# EAGLE design EskomSePush (EAGLE 9.6.2)
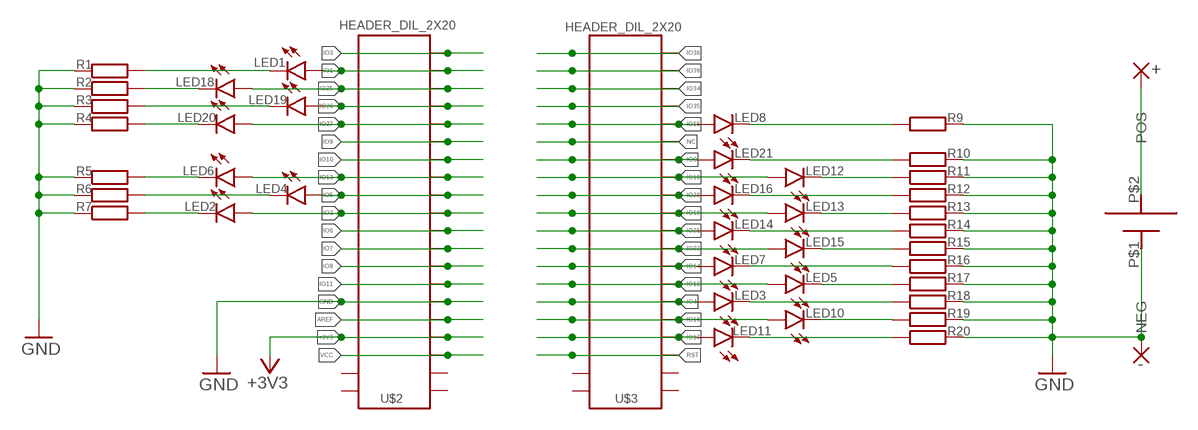
[diagram p0: schematic, sheet 1]

## Parts
+  WIREPADSMD2,54-5,08  [SMD2,54-5,08]
-  WIREPADSMD2,54-5,08  [SMD2,54-5,08]
LED1  LEDCHIPLED_1206  [CHIPLED_1206]
LED2  LEDCHIPLED_1206  [CHIPLED_1206]
LED3  LEDCHIPLED_1206  [CHIPLED_1206]
LED4  LEDCHIPLED_1206  [CHIPLED_1206]
LED5  LEDCHIPLED_1206  [CHIPLED_1206]
LED6  LEDCHIPLED_1206  [CHIPLED_1206]
LED7  LEDCHIPLED_1206  [CHIPLED_1206]
LED8  LEDCHIPLED_1206  [CHIPLED_1206]
LED10  LEDCHIPLED_1206  [CHIPLED_1206]
LED11  LEDCHIPLED_1206  [CHIPLED_1206]
LED12  LEDCHIPLED_1206  [CHIPLED_1206]
LED13  LEDCHIPLED_1206  [CHIPLED_1206]
LED14  LEDCHIPLED_1206  [CHIPLED_1206]
LED15  LEDCHIPLED_1206  [CHIPLED_1206]
LED16  LEDCHIPLED_1206  [CHIPLED_1206]
LED18  LEDCHIPLED_1206  [CHIPLED_1206]
LED19  LEDCHIPLED_1206  [CHIPLED_1206]
LED20  LEDCHIPLED_1206  [CHIPLED_1206]
LED21  LEDCHIPLED_1206  [CHIPLED_1206]
R1  R-EU_R1206  [R1206]
R2  R-EU_R1206  [R1206]
R3  R-EU_R1206  [R1206]
R4  R-EU_R1206  [R1206]
R5  R-EU_R1206  [R1206]
R6  R-EU_R1206  [R1206]
R7  R-EU_R1206  [R1206]
R9  R-EU_R1206  [R1206]
R10  R-EU_R1206  [R1206]
R11  R-EU_R1206  [R1206]
R12  R-EU_R1206  [R1206]
R13  R-EU_R1206  [R1206]
R14  R-EU_R1206  [R1206]
R15  R-EU_R1206  [R1206]
R16  R-EU_R1206  [R1206]
R17  R-EU_R1206  [R1206]
R18  R-EU_R1206  [R1206]
R19  R-EU_R1206  [R1206]
R20  R-EU_R1206  [R1206]
U$1  21700BATTERYHOLDER  [21700BATTERYHOLDER]
U$2  HEADER_DIL_2X20  [HEADER_DIL_2X20]
U$3  HEADER_DIL_2X20  [HEADER_DIL_2X20]

## Nets
+3V3: U$2.P$17 U$2.P$37
AREF: U$2.P$16 U$2.P$36
GND: -.1(P) R1.1 R2.1 R3.1 R4.1 R5.1 R6.1 R7.1 R9.2 R10.2 R11.2 R12.2 R13.2 R14.2 R15.2 R16.2 R17.2 R18.2 R19.2 R20.2 U$1.P$1(NEG) U$2.P$15 U$2.P$35
IO0: LED21.A U$3.P$7 U$3.P$27
IO1: LED1.A U$2.P$2 U$2.P$22
IO2: LED2.A U$2.P$10 U$2.P$30
IO3: U$2.P$1 U$2.P$21
IO4: LED3.A U$3.P$15 U$3.P$35
IO5: LED4.A U$2.P$9 U$2.P$29
IO6: U$2.P$11 U$2.P$31
IO7: U$2.P$12 U$2.P$32
IO8: U$2.P$13 U$2.P$33
IO9: U$2.P$6 U$2.P$26
IO10: U$2.P$7 U$2.P$27
IO11: U$2.P$14 U$2.P$34
IO12: LED5.A U$3.P$14 U$3.P$34
IO13: LED6.A U$2.P$8 U$2.P$28
IO14: LED7.A U$3.P$13 U$3.P$33
IO15: LED8.A U$3.P$5 U$3.P$25
IO16: LED10.A U$3.P$16 U$3.P$36
IO17: LED11.A U$3.P$17 U$3.P$37
IO18: LED12.A U$3.P$8 U$3.P$28
IO19: LED13.A U$3.P$10 U$3.P$30
IO21: LED14.A U$3.P$11 U$3.P$31
IO22: LED15.A U$3.P$12 U$3.P$32
IO23: LED16.A U$3.P$9 U$3.P$29
IO25: LED18.A U$2.P$3 U$2.P$23
IO26: LED19.A U$2.P$4 U$2.P$24
IO27: LED20.A U$2.P$5 U$2.P$25
IO34: U$3.P$3 U$3.P$23
IO35: U$3.P$4 U$3.P$24
IO36: U$3.P$1 U$3.P$21
IO39: U$3.P$2 U$3.P$22
N$1: LED1.C R1.2
N$2: LED18.C R2.2
N$3: LED19.C R3.2
N$5: LED20.C R4.2
N$6: LED4.C R6.2
N$7: LED2.C R7.2
N$8: LED6.C R5.2
N$9: LED8.C R9.1
N$10: LED21.C R10.1
N$11: LED12.C R11.1
N$12: LED16.C R12.1
N$13: LED13.C R13.1
N$14: LED14.C R14.1
N$15: LED15.C R15.1
N$16: LED5.C R17.1
N$17: LED7.C R16.1
N$18: LED3.C R18.1
N$19: LED10.C R19.1
N$20: LED11.C R20.1
N$28: +.1(P) U$1.P$2(POS)
NC: U$3.P$6 U$3.P$26
RST: U$3.P$18 U$3.P$38
VCC: U$2.P$18 U$2.P$38
Unconnected: U$2.P$19 U$2.P$20 U$2.P$39 U$2.P$40 U$3.P$19 U$3.P$20 U$3.P$39 U$3.P$40

## Library data of the parts
+ - = wirepad:WIREPAD: Wire PAD connect wire on PCB
LED1-LED8 LED10-LED16 LED18-LED21 = led:LED: LED OSRAM: - CHIPLED LG R971, LG N971, LY N971, LG Q971, LY Q971, LO R971, LY R971 LH N974, LH R974 LS Q976, LO Q976, LY Q976 LO Q996 - Hyper CHIPLED LW Q18S LB Q993, LB Q99A, LB R99A - SideLED LS A670, LO A670, LY A670, LG A670, LP A670 LB A673, LV A673, LT A673, LW A673 LH A674 LY A675 LS A676, LA A676, LO A676, LY A676, LW A676 LS A679, LY A679, LG A679 - Hyper Micro SIDELED® LS Y876, LA Y876, LO Y876, LY Y876 LT Y87S - SmartLED LW L88C, LW L88S LB L89C, LB L89S, LG L890 LS L89K, LO L89K, LY L89K LS L896, LA L896, LO L896, LY L896 - TOPLED LS T670, LO T670, LY T670, LG T670, LP T670 LSG T670, LSP T670, LSY T670, LOP T670, LYG T670 LG T671, LOG T671, LSG T671 LB T673, LV T673, LT T673, LW T673 LH T674 LS T676, LA T676, LO T676, LY T676, LB T676, LH T676, LSB T676, LW T676 LB T67C, LV T67C, LT T67C, LS T67K, LO T67K, LY T67K, LW E67C LS E67B, LA E67B, LO E67B, LY E67B, LB E67C, LV E67C, LT E67C LW T67C LS T679, LY T679, LG T679 LS T770, LO T770, LY T770, LG T770, LP T770 LB T773, LV T773, LT T773, LW T773 LH T774 LS E675, LA E675, LY E675, LS T675 LS T776, LA T776, LO T776, LY T776, LB T776 LHGB T686 LT T68C, LB T68C - Hyper Mini TOPLED® LB M676 - Mini TOPLED Santana® LG M470 LS M47K, LO M47K, LY M47K Source: http://www.osram.convergy.de LUXEON: - LUMILED® LXK2-PW12-R00, LXK2-PW12-S00, LXK2-PW14-U00, LXK2-PW14-V00 LXK2-PM12-R00, LXK2-PM12-S00, LXK2-PM14-U00 LXK2-PE12-Q00, LXK2-PE12-R00, LXK2-PE12-S00, LXK2-PE14-T00, LXK2-PE14-U00 LXK2-PB12-K00, LXK2-PB12-L00, LXK2-PB12-M00, LXK2-PB14-N00, LXK2-PB14-P00, LXK2-PB14-Q00 LXK2-PR12-L00, LXK2-PR12-M00, LXK2-PR14-Q00, LXK2-PR14-R00 LXK2-PD12-Q00, LXK2-PD12-R00, LXK2-PD12-S00 LXK2-PH12-R00, LXK2-PH12-S00 LXK2-PL12-P00, LXK2-PL12-Q00, LXK2-PL12-R00 Source: www.luxeon.com KINGBRIGHT: KA-3528ASYC Source: www.kingbright.com
R1-R7 R9-R20 = rcl:R-EU_: RESISTOR, European symbol; SPICEPREFIX: R
U$1 = 21700 Battery holder:21700BATTERYHOLDER
U$2 U$3 = Header SMT:HEADER_DIL_2X20

## Board
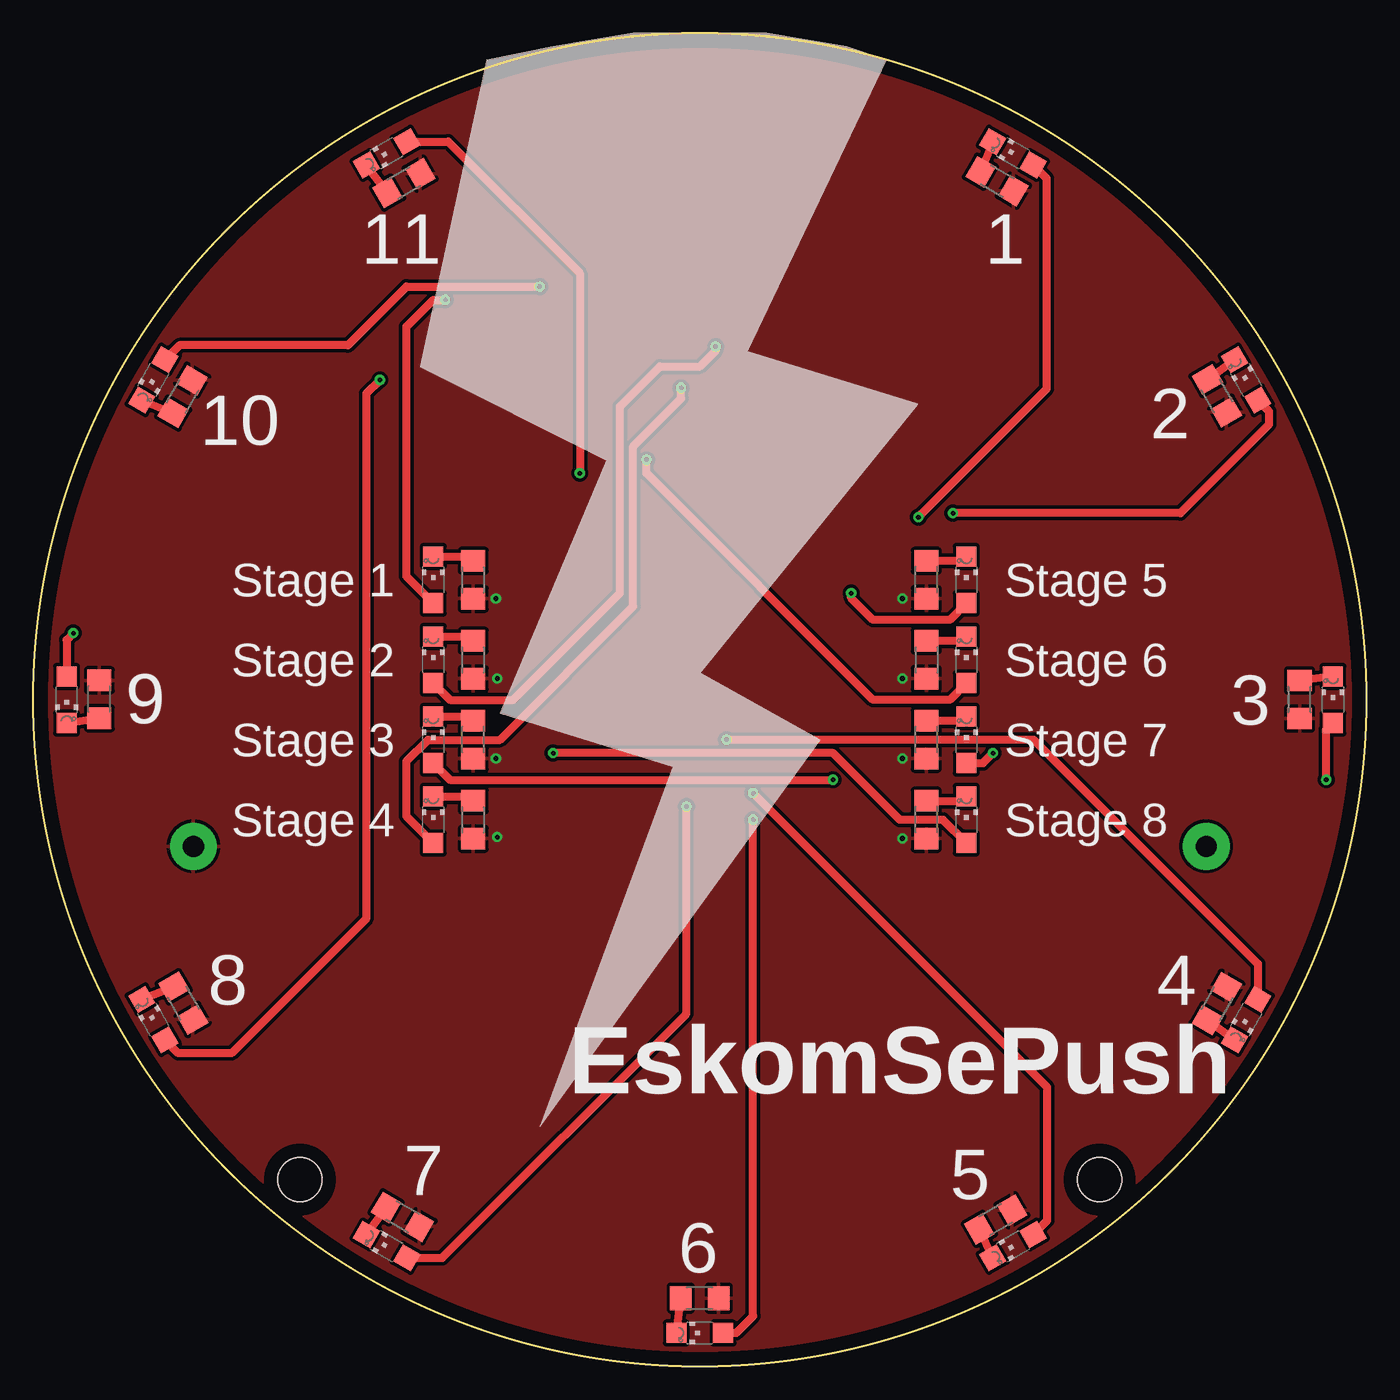
[diagram p1: board, top side]
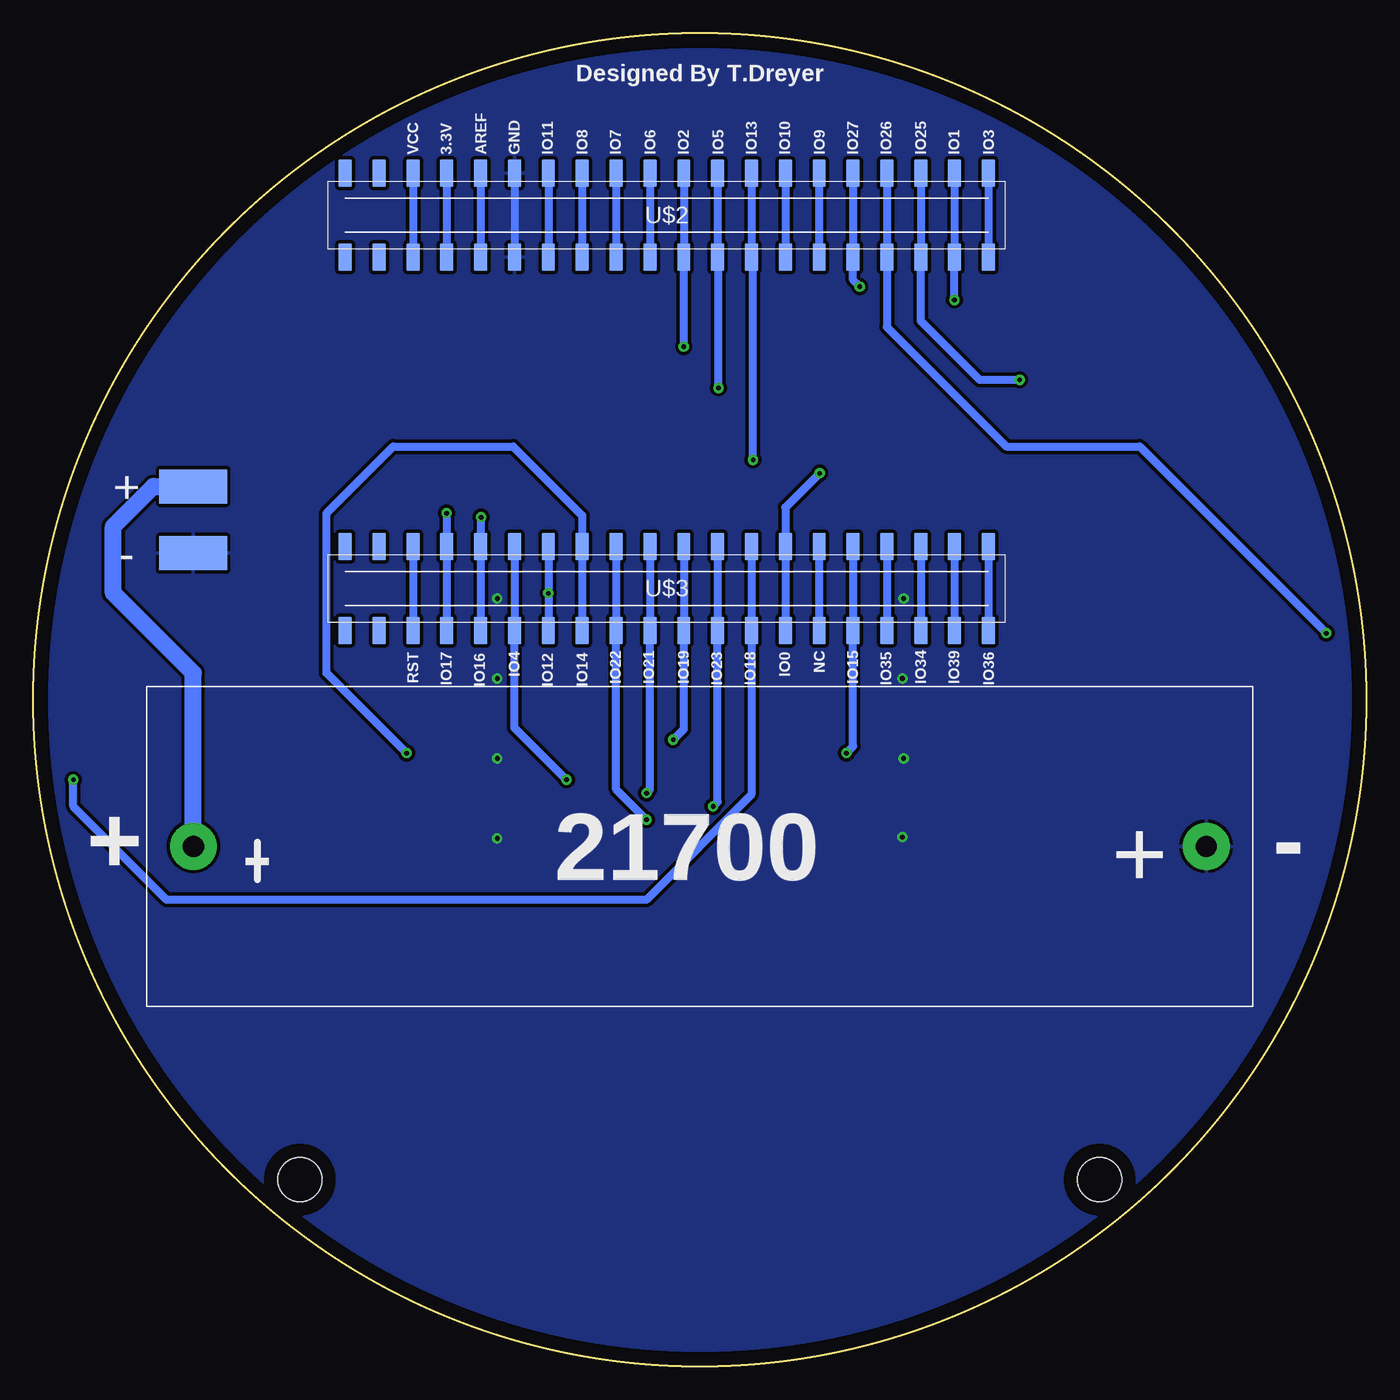
[diagram p2: board, bottom side, seen from below]

Size 100 x 100 mm. Coordinates in mm from the lower left corner, seen from the top.
Outline: circle at 50,50 radius 50
Copper layers (1*16): Top 0.035mm / dielectric 1.5mm / Bottom 0.035mm
Design rules "default *": minimum track width 6mil, minimum drill 0.35mm, track to track 10mil, track to pad 6mil, pad to pad 6mil, via to via 6mil, smd to smd 6mil, copper to edge 40mil, drill to drill 6mil, minimum pad ring 10mil, minimum via ring 8mil, stop-mask expansion 4mil, vias tented up to drill 20mil, thermal gap 10mil
Holes 3.3 mm at 20,14 80,14

### Footprints (pad centres in the part's own frame; a part is rotated, then mirrored left to right if it is on the bottom)
SMD2,54-5,08 = smd 2.54 x 5.08: 1 0,0
CHIPLED_1206 = smd 1.5 x 1.5: A 0,-1.75; C 0,1.75
R1206 = smd 1.6 x 1.803: 1 -1.422,0; 2 1.422,0
21700BATTERYHOLDER = drill 1.6 pad 3.5: P$1 -38,0; P$2 38,0
HEADER_DIL_2X20 = smd 1.02 x 2.1: P$1 0,3.15; P$2 2.54,3.15; P$3 5.08,3.15; P$4 7.62,3.15; P$5 10.16,3.15; P$6 12.7,3.15; P$7 15.24,3.15; P$8 17.78,3.15; P$9 20.32,3.15; P$10 22.86,3.15; P$11 25.4,3.15; P$12 27.94,3.15; P$13 30.48,3.15; P$14 33.02,3.15; P$15 35.56,3.15; P$16 38.1,3.15; P$17 40.64,3.15; P$18 43.18,3.15; P$19 45.72,3.15; P$20 48.26,3.15; P$21 0,-3.15; P$22 2.54,-3.15; P$23 5.08,-3.15; P$24 7.62,-3.15; P$25 10.16,-3.15; P$26 12.7,-3.15; P$27 15.24,-3.15; P$28 17.78,-3.15; P$29 20.32,-3.15; P$30 22.86,-3.15; P$31 25.4,-3.15; P$32 27.94,-3.15; P$33 30.48,-3.15; P$34 33.02,-3.15; P$35 35.56,-3.15; P$36 38.1,-3.15; P$37 40.64,-3.15; P$38 43.18,-3.15; P$39 45.72,-3.15; P$40 48.26,-3.15

### Placement (x,y rotation side)
+  88,66 270 bottom
-  88,61 270 bottom
LED1  30,59 0 top
LED2  30,53 0 top
LED3  30,47 0 top
LED4  30,41 0 top
LED5  70,59 0 top
LED6  70,53 0 top
LED7  70,47 0 top
LED8  70,41 0 top
LED10  73.5,91 60 top
LED11  91,74 30 top
LED12  97.5,50 0 top
LED13  91,26 150 top
LED14  73.5,9 120 top
LED15  50,2.5 90 top
LED16  26.5,9 60 top
LED18  9,26 30 top
LED19  2.5,50 180 top
LED20  9,74 150 top
LED21  26.5,91 120 top
R1  33,59 90 top
R2  11.25,27.24 120 top
R3  4.95,50.04 270 top
R4  11.2,72.74 240 top
R5  67,53 90 top
R6  33,41 90 top
R7  33,53 90 top
R9  67,41 270 top
R10  27.8,88.76 30 top
R11  95,50.02 270 top
R12  27.7,11.2 330 top
R13  88.8,27.2 60 top
R14  72.2,11 30 top
R15  50,5.1 0 top
R16  67,47 270 top
R17  67,59 270 top
R18  33,47 270 top
R19  72.3,88.9 330 top
R20  88.8,72.8 300 top
U$1  50,39 180 bottom
U$2  28.34,86.35 180 bottom
U$3  28.34,58.35 180 bottom

### Tracks (layer width: path | path; a pad name or v marks a point on that pad's centre or on a via)
+3V3
  Bottom 0.61: U$2.P$37 U$2.P$17
AREF
  Bottom 0.61: U$2.P$36 U$2.P$16
GND  (via drill 0.35)
  Bottom 0.61: U$2.P$35 U$2.P$15
  other vias: 65.2,57.6 65.2,51.6 65.2,45.6 65.2,39.6 34.8,39.7 34.7,45.6 34.8,51.6 34.7,57.6
  pour Top: 0,100 0,0 100,0 100,100
  pour Bottom: 0,100 0,0 100,0 100,100
IO0  (via drill 0.35)
  Top 0.61: LED21.A 31.12,91.88 41,82 v41,67
  Bottom 0.61: U$3.P$7 U$3.P$27 43.58,64.42 v41,67
IO1  (via drill 0.35)
  Top 0.61: LED1.A 28,59.25 28,78 30,80 v30.9,80
  Bottom 0.61: U$2.P$22 U$2.P$2 30.9,83.18 v30.9,80
IO2  (via drill 0.35)
  Top 0.61: LED2.A 31.25,50 36,50 44,58 44,72 47,75 50,75 51.2,76.2 v51.2,76.5
  Bottom 0.61: U$2.P$30 U$2.P$10 v51.2,76.5
IO3
  Bottom 0.61: U$2.P$21 U$2.P$1
IO4  (via drill 0.35)
  Top 0.61: LED3.A 31.25,44 v60,44
  Bottom 0.61: U$3.P$35 U$3.P$15 63.9,47.9 v60,44
IO5  (via drill 0.35)
  Top 0.61: LED4.A 28,41.25 28,45.4 29.6,47 35,47 45,57 45,69 48.6,72.6 v48.6,73.4
  Bottom 0.61: U$2.P$29 U$2.P$9 48.6,83.14 v48.6,73.4
IO6
  Bottom 0.61: U$2.P$31 U$2.P$11
IO7
  Bottom 0.61: U$2.P$32 U$2.P$12
IO8
  Bottom 0.61: U$2.P$33 U$2.P$13
IO9
  Bottom 0.61: U$2.P$26 U$2.P$6
IO10
  Bottom 0.61: U$2.P$27 U$2.P$7
IO11
  Bottom 0.61: U$2.P$34 U$2.P$14
IO12  (via drill 0.35)
  Top 0.61: LED5.A 68.75,56 63,56 61.36,57.64 v61.36,58
  Bottom 0.61: U$3.P$34 v61.36,58 U$3.P$14
IO13  (via drill 0.35)
  Top 0.61: LED6.A 68.75,50 63,50 46,67 v46,68
  Bottom 0.61: U$2.P$28 U$2.P$8 46,83.08 v46,68
IO14  (via drill 0.35)
  Top 0.61: LED7.A 71.25,45.25 v72,46
  Bottom 0.61: U$3.P$13 U$3.P$33 58.82,63.82 64,69 73,69 78,64 78,52 v72,46
IO15  (via drill 0.35)
  Top 0.61: LED8.A 68.25,41 65,41 60,46 v39,46
  Bottom 0.61: U$3.P$25 U$3.P$5 38.5,46.5 v39,46
IO16  (via drill 0.35)
  Top 0.61: LED10.A 76.02,89.12 76.02,73.32 v66.4,63.7
  Bottom 0.61: U$3.P$16 U$3.P$36 66.44,63.66 v66.4,63.7
IO17  (via drill 0.35)
  Top 0.61: LED11.A 92.71,71.65 92.71,70.65 86.06,64 v69,64
  Bottom 0.61: U$3.P$17 U$3.P$37 69,61.52 v69,64
IO18  (via drill 0.35)
  Top 0.61: v97,44 97,47.75 LED12.A
  Bottom 0.61: U$3.P$28 U$3.P$8 46.12,42.88 54,35 90,35 97,42 v97,44
IO19  (via drill 0.35)
  Top 0.61: LED13.A 91.88,30.18 75.06,47 v52,47
  Bottom 0.61: U$3.P$30 U$3.P$10 51.2,47.8 v52,47
IO21  (via drill 0.35)
  Top 0.61: v54,43 76.07,20.93 76.07,10.93 LED14.A
  Bottom 0.61: U$3.P$31 U$3.P$11 53.74,43.26 v54,43
IO22  (via drill 0.35)
  Top 0.61: LED15.A 52.75,2.5 54,3.75 v54,41
  Bottom 0.61: U$3.P$32 U$3.P$12 56.28,43.28 v54,41
IO23  (via drill 0.35)
  Top 0.61: LED16.A 30.68,8.12 49,26.44 v49,42
  Bottom 0.61: U$3.P$29 U$3.P$9 48.66,42.34 v49,42
IO25  (via drill 0.35)
  Top 0.61: LED18.A 10.88,23.48 14.88,23.48 25,33.61 25,73 v26,74
  Bottom 0.61: U$2.P$23 U$2.P$3 33.42,78.42 29,74 v26,74
IO26  (via drill 0.35)
  Top 0.61: v3,55 2.5,54.5 LED19.A
  Bottom 0.61: U$2.P$24 U$2.P$4 35.96,77.96 27,69 17,69 v3,55
IO27  (via drill 0.35)
  Top 0.61: LED20.A 10.96,76.61 23.61,76.61 28,81 v38,81
  Bottom 0.61: U$2.P$25 U$2.P$5 38.5,81.5 v38,81
IO34
  Bottom 0.61: U$3.P$23 U$3.P$3
IO35
  Bottom 0.61: U$3.P$24 U$3.P$4
IO36
  Bottom 0.61: U$3.P$21 U$3.P$1
IO39
  Bottom 0.61: U$3.P$22 U$3.P$2
N$1
  Top 0.61: LED1.C 33,60.75 R1.2
N$2
  Top 0.61: LED18.C R2.2
N$3
  Top 0.61: LED19.C R3.2
N$5
  Top 0.61: LED20.C R4.2
N$6
  Top 0.61: LED4.C 33,42.75 R6.2
N$7
  Top 0.61: LED2.C 33,54.75 R7.2
N$8
  Top 0.61: LED6.C 70,54.42 R5.2
N$9
  Top 0.61: R9.1 70,42.42 LED8.C
N$10
  Top 0.61: LED21.C R10.1
N$11
  Top 0.61: LED12.C R11.1
N$12
  Top 0.61: LED16.C R12.1
N$13
  Top 0.61: LED13.C R13.1
N$14
  Top 0.61: LED14.C R14.1
N$15
  Top 0.61: LED15.C R15.1
N$16
  Top 0.61: LED5.C 70,60.42 R17.1
N$17
  Top 0.61: LED7.C 70,48.42 R16.1
N$18
  Top 0.61: LED3.C 33,48.75 R18.1
N$19
  Top 0.61: LED10.C R19.1
N$20
  Top 0.61: LED11.C R20.1
N$28
  Bottom 1.27: U$1.P$2 88,52 94,58 94,63 91,66 +.1
NC
  Bottom 0.61: U$3.P$26 U$3.P$6
RST
  Bottom 0.61: U$3.P$38 U$3.P$18
VCC
  Bottom 0.61: U$2.P$38 U$2.P$18

### Text on the board
tPlace: 11 | 1 | 2 | 10 | Stage 1 | Stage 5 | Stage 2 | Stage 6 | 9 | 3 | Stage 3 | Stage 7 | Stage 4 | Stage 8 | 8 | 4 | EskomSePush | 7 | 5 | 6
bPlace: Designed By T.Dreyer | IO3 | IO1 | IO25 | IO26 | IO27 | IO9 | IO10 | IO13 | IO5 | IO2 | IO6 | IO7 | IO8 | IO11 | GND | AREF | 3.3V | VCC | IO36 | IO39 | IO34 | IO35 | IO15 | NC | IO0 | IO18 | IO23 | IO19 | IO21 | IO22 | IO14 | IO12 | IO4 | IO16 | IO17 | RST | - | +